# Altium schematic sheet Power.SchDoc
size A4
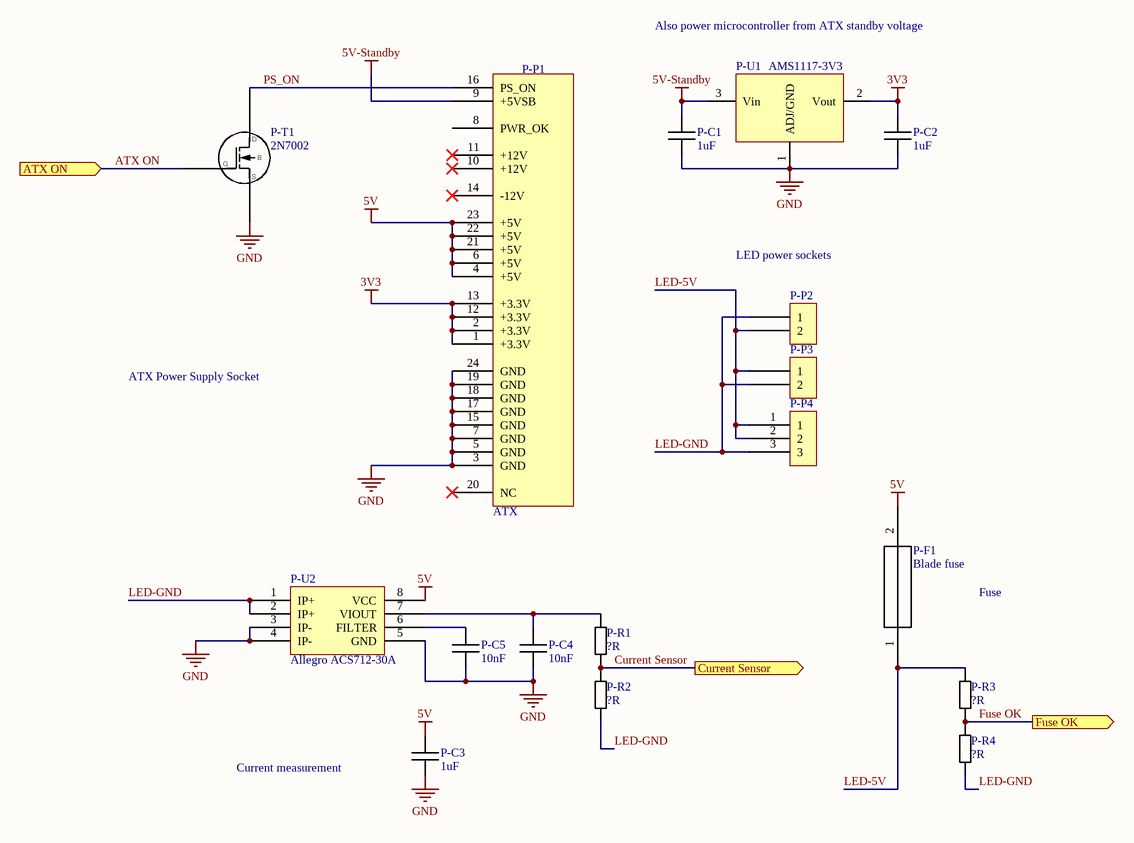
[diagram p0: Power.SchDoc]

## Parts
P-C1  1uF  [C 0805 / 2012]
P-C2  1uF  [C 0805 / 2012]
P-C3  1uF  [C 0805 / 2012]
P-C4  10nF  [R 0805 / 2012 wide]
P-C5  10nF  [C 0805 / 2012]
P-F1  Blade fuse  [Blade fuse receptacle]
P-P1  ATX  [ATX]
P-P2  Header 2x1  [Screw terminal 2 pin RM 5mm]  (value not drawn)
P-P3  Header 2x1  [Screw terminal 2 pin RM 5mm]  (value not drawn)
P-P4  Header 1x3  [Screw terminal 3 pin RM 7.62mm]  (value not drawn)
P-R1  ?R  [R 0805 / 2012]
P-R2  ?R  [R 0805 / 2012]
P-R3  ?R  [R 0805 / 2012]
P-R4  ?R  [R 0805 / 2012]
P-T1  2N7002  [SOT-23-3]
P-U1  AMS1117-3V3  [SOT-223-3]
P-U2  Allegro ACS712-30A  [SOIC-8]

## Ports
ATX ON (in), Current Sensor (out), Fuse OK (out)

## Nets
3V3: P-C2.1 P-P1.1(+3.3V) P-P1.2(+3.3V) P-P1.12(+3.3V) P-P1.13(+3.3V) P-U1.2(Vout)
5V: P-C3.1 P-F1.2 P-P1.4(+5V) P-P1.6(+5V) P-P1.21(+5V) P-P1.22(+5V) P-P1.23(+5V) P-U2.8(VCC)
5V-Standby: P-C1.1 P-P1.9(+5VSB) P-U1.3(Vin)
GND: P-C1.2 P-C2.2 P-C3.2 P-C4.2 P-C5.2 P-P1.3(GND) P-P1.5(GND) P-P1.7(GND) P-P1.15(GND) P-P1.17(GND) P-P1.18(GND) P-P1.19(GND) P-P1.24(GND) P-T1.2 P-U1.1(ADJ/GND) P-U2.3(IP-) P-U2.4(IP-) P-U2.5(GND)
ATX ON: P-T1.1 ; port ATX ON
Current Sensor: P-R1.1 P-R2.2 ; port Current Sensor
Fuse OK: P-R3.1 P-R4.2 ; port Fuse OK
LED-5V: P-F1.1 P-P2.2 P-P3.1 P-P4.1 P-P4.2 P-R3.2
LED-GND: P-P2.1 P-P3.2 P-P4.3 P-R2.1 P-R4.1 P-U2.1(IP+) P-U2.2(IP+)
PS_ON: P-P1.16(PS_ON) P-T1.3
NetP-C4_1: P-C4.1 P-R1.2 P-U2.7(VIOUT)
NetP-C5_1: P-C5.1 P-U2.6(FILTER)

Not connected (* = marked no-connect by the designer): P-P1 8(PWR_OK) 10(+12V)* 11(+12V)* 14(-12V)* 20(NC)*

## Notes on the sheet
- Also power microcontroller from ATX standby voltage
- LED power sockets
- ATX Power Supply Socket
- Fuse
- Current measurement

## Library data of the parts
P-C1-P-C5 = Capacitor
P-F1 = Fuse
P-P1 = ATX sorted
P-R1-P-R4 = Resistor
P-T1 = 2N7002: N-FET
P-U1 = AMS1117: LDO 3.3V/5V/12V
P-U2 = Allegro ACS712: Analog current sensor